# Altium schematic sheet FC_RGB.SchDoc
size A2; SheetNumber: 1; SheetTotal: 1
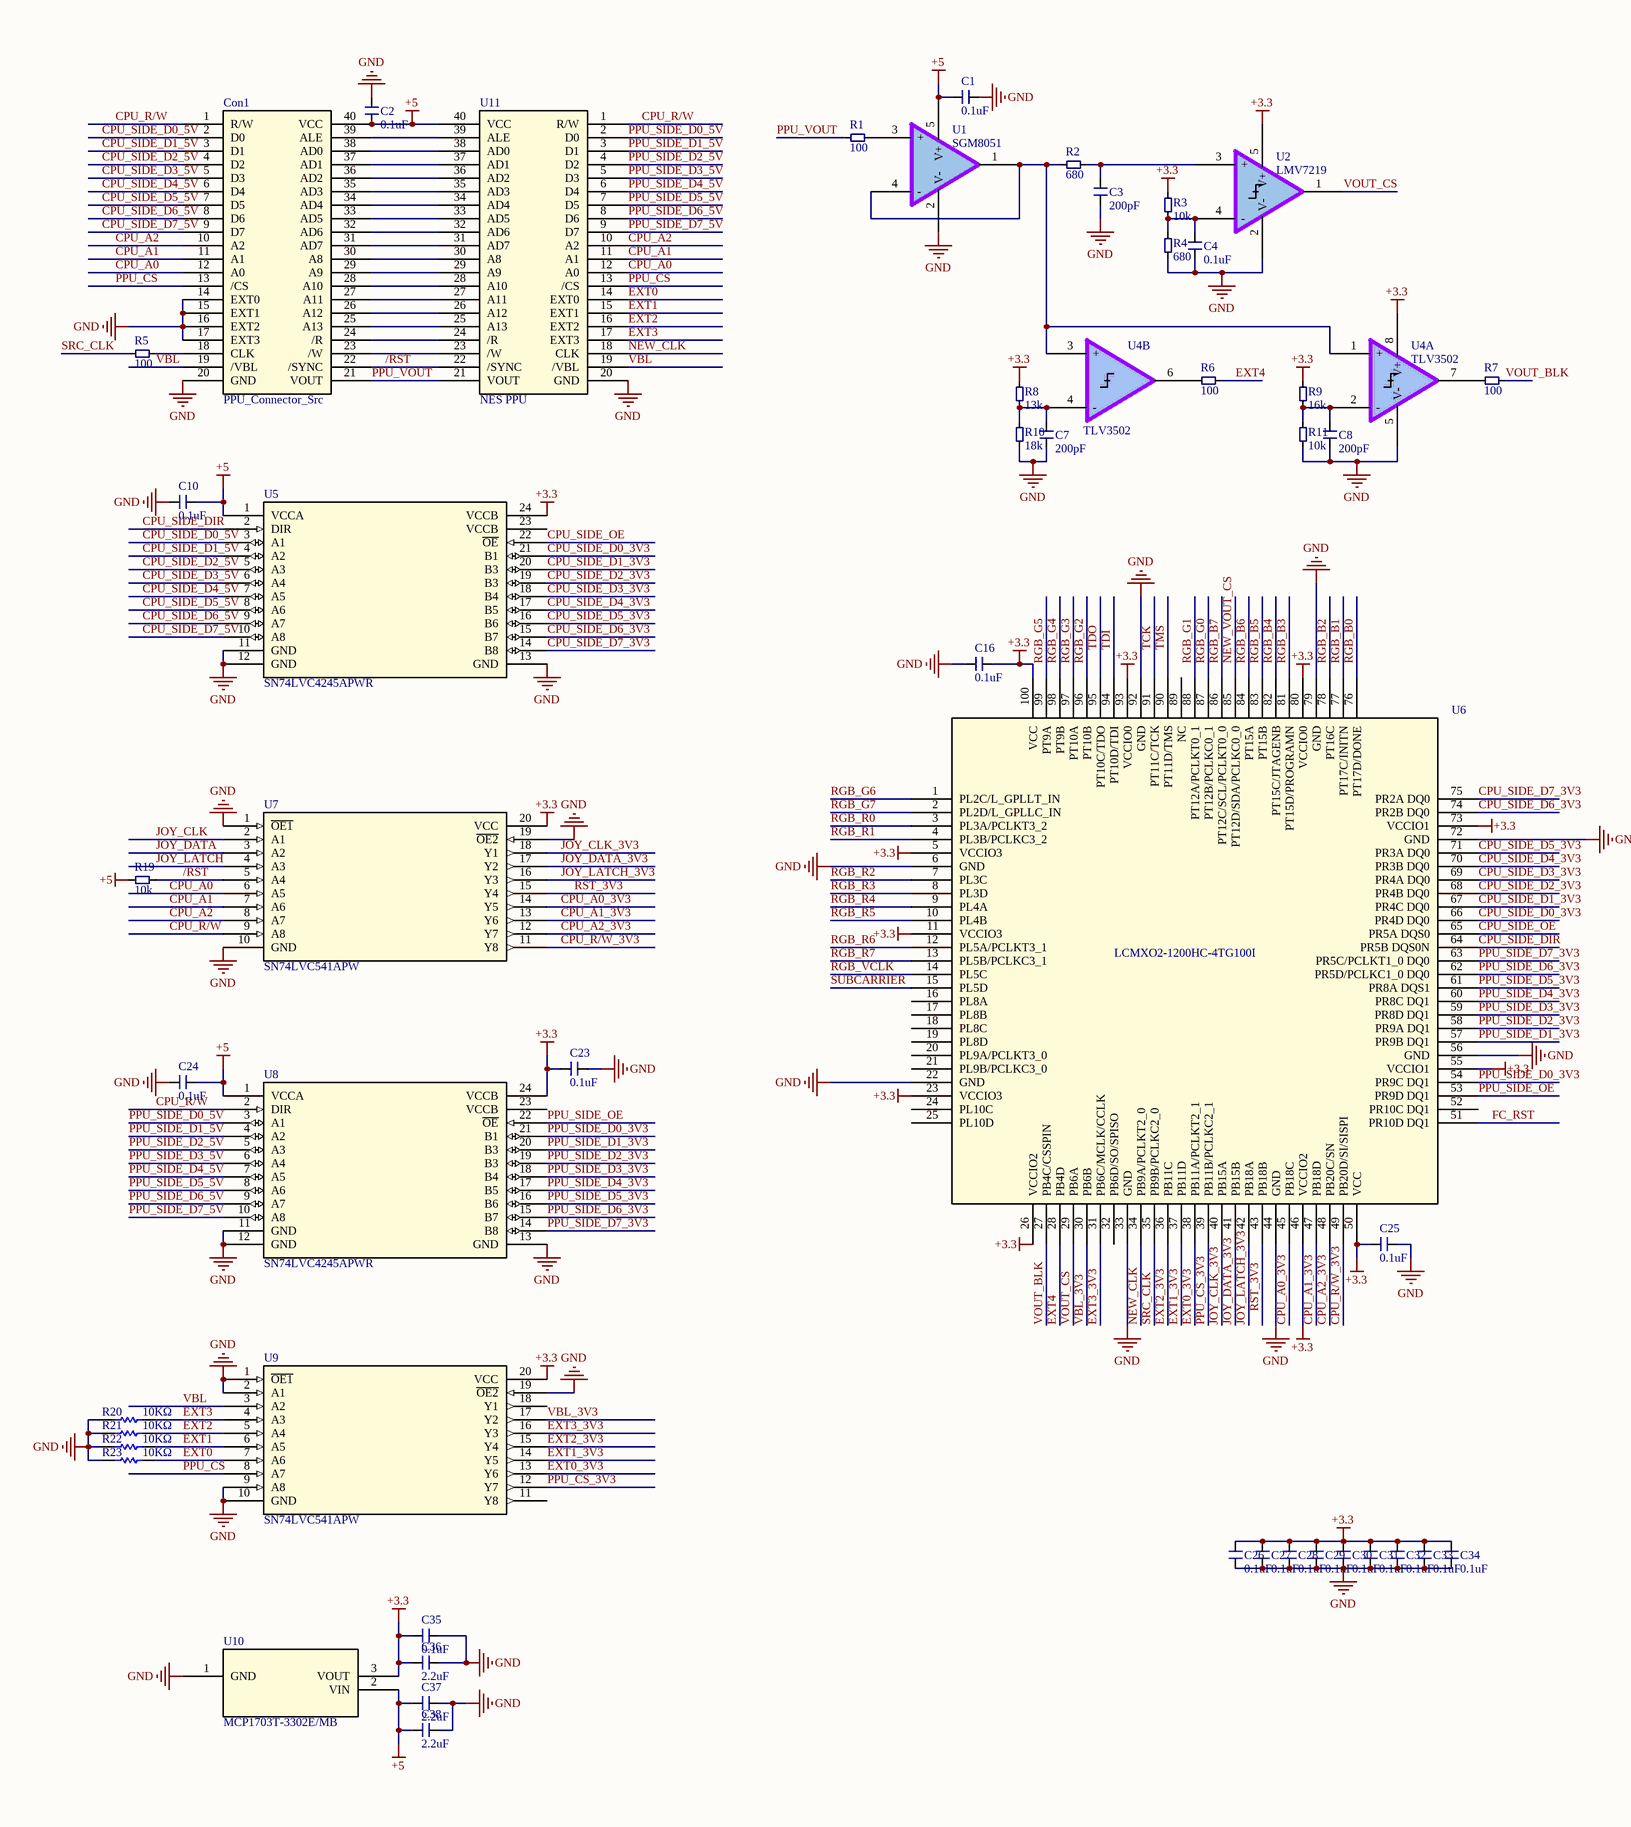
[diagram p0: FC_RGB.SchDoc, left]
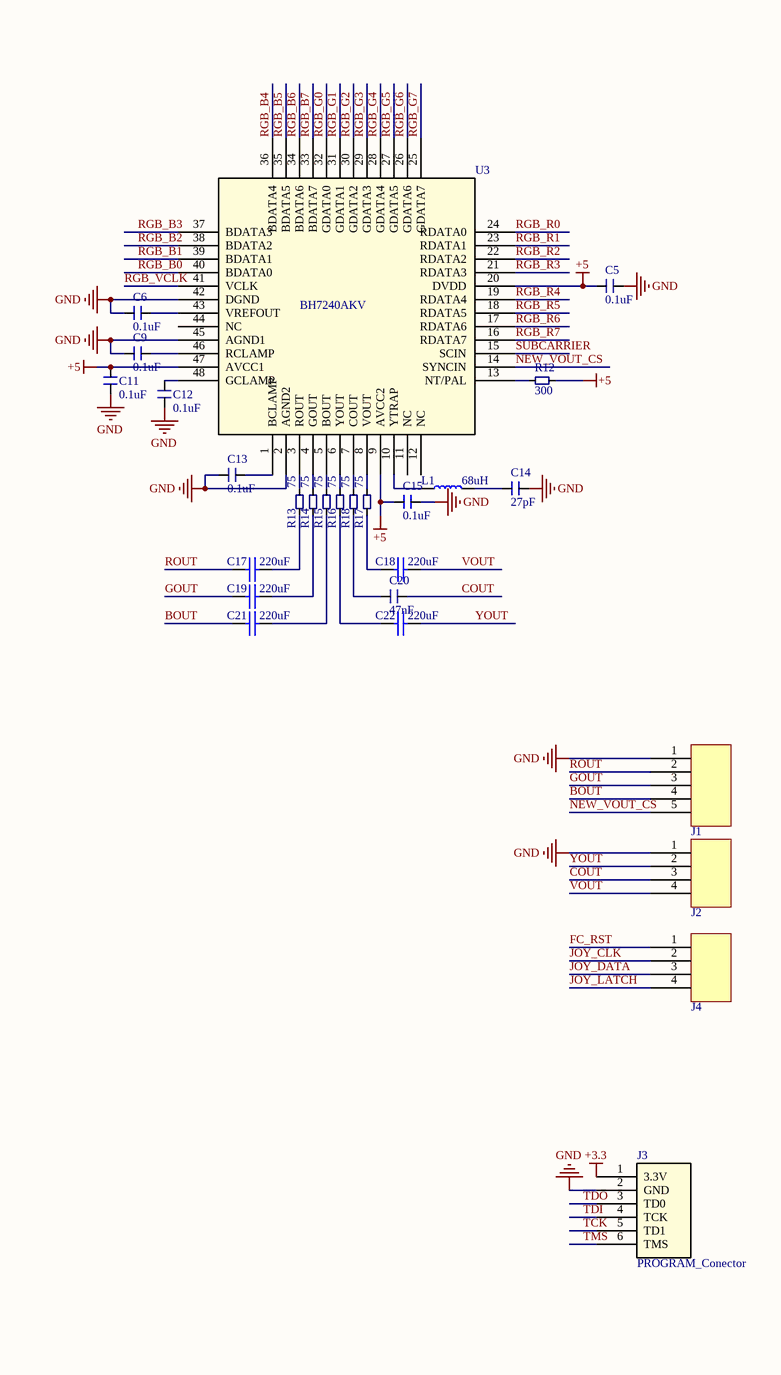
[diagram p1: FC_RGB.SchDoc, right]

## Parts
C1  value 0.1uF  [C0402]  (hidden comment: Cap)
C2  value 0.1uF  [C0805]  (hidden comment: Cap)
C3  value 200pF  [C0402]  (hidden comment: Cap)
C4  value 0.1uF  [C0402]  (hidden comment: Cap)
C5  value 0.1uF  [C0402]  (hidden comment: CAP)
C6  value 0.1uF  [C0402]  (hidden comment: CAP)
C7  value 200pF  [C0402]  (hidden comment: Cap)
C8  value 200pF  [C0402]  (hidden comment: Cap)
C9  value 0.1uF  [C0402]  (hidden comment: CAP)
C10  value 0.1uF  [C0402]  (hidden comment: CAP)
C11  value 0.1uF  [C0402]  (hidden comment: CAP)
C12  value 0.1uF  [C0402]  (hidden comment: CAP)
C13  value 0.1uF  [C0402]  (hidden comment: CAP)
C14  value 27pF  [C0402]  (hidden comment: CAP)
C15  value 0.1uF  [C0402]  (hidden comment: CAP)
C16  value 0.1uF  [C0402]  (hidden comment: Cap)
C17  220uF  [C 1206_L]
C18  220uF  [C 1206_L]
C19  220uF  [C 1206_L]
C20  value 47nF  [C0402]  (hidden comment: CAP)
C21  220uF  [C 1206_L]
C22  220uF  [C 1206_L]
C23  value 0.1uF  [C0402]  (hidden comment: CAP)
C24  value 0.1uF  [C0402]  (hidden comment: CAP)
C25  value 0.1uF  [C0402]  (hidden comment: Cap)
C26  value 0.1uF  [C0402]  (hidden comment: CAP)
C27  value 0.1uF  [C0402]  (hidden comment: CAP)
C28  value 0.1uF  [C0402]  (hidden comment: CAP)
C29  value 0.1uF  [C0402]  (hidden comment: CAP)
C30  value 0.1uF  [C0402]  (hidden comment: CAP)
C31  value 0.1uF  [C0402]  (hidden comment: CAP)
C32  value 0.1uF  [C0402]  (hidden comment: CAP)
C33  value 0.1uF  [C0402]  (hidden comment: CAP)
C34  value 0.1uF  [C0402]  (hidden comment: CAP)
C35  value 0.1uF  [C0603]  (hidden comment: Cap)
C36  value 2.2uF  [C0603]  (hidden comment: Cap)
C37  value 2.2uF  [C0805]  (hidden comment: Cap)
C38  value 2.2uF  [C0805]  (hidden comment: Cap)
Con1  PPU_Connector_Src  [DIP40_SRC]
J1  CN  [CN5_1.25_90]  (value not drawn)
J2  CN  [CN4_1.25_90]  (value not drawn)
J3  PROGRAM_Conector  [CON_PROGRAM]
J4  CN  [CN4_1.25_90]  (value not drawn)
L1  68uH  [L 0805]
R1  value 100  [R-0402]  (hidden comment: RES_SMD)
R2  value 680  [R-0402]  (hidden comment: RES_SMD)
R3  value 10k  [R-0402]  (hidden comment: RES_SMD)
R4  value 680  [R-0402]  (hidden comment: RES_SMD)
R5  value 100  [R-0402]  (hidden comment: RES_SMD)
R6  value 100  [R-0402]  (hidden comment: RES_SMD)
R7  value 100  [R-0402]  (hidden comment: RES_SMD)
R8  value 13k  [R-0402]  (hidden comment: RES_SMD)
R9  value 16k  [R-0402]  (hidden comment: RES_SMD)
R10  value 18k  [R-0402]  (hidden comment: RES_SMD)
R11  value 10k  [R-0402]  (hidden comment: RES_SMD)
R12  value 300  [R-0402]  (hidden comment: RES_SMD)
R13  value 75  [R-0402]  (hidden comment: RES_SMD)
R14  value 75  [R-0402]  (hidden comment: RES_SMD)
R15  value 75  [R-0402]  (hidden comment: RES_SMD)
R16  value 75  [R-0402]  (hidden comment: RES_SMD)
R17  value 75  [R-0402]  (hidden comment: RES_SMD)
R18  value 75  [R-0402]  (hidden comment: RES_SMD)
R19  value 10k  [R-0402]  (hidden comment: RES_SMD)
R20  10KΩ  [0603_R]
R21  10KΩ  [0603_R]
R22  10KΩ  [0603_R]
R23  10KΩ  [0603_R]
U1  SGM8051  [SOT-23-5]
U2  LMV7219  [SOT-23-5]
U3  BH7240AKV  [LQFP48-7*7]
U4  TLV3502  [SOP-8-SMALL]  (parts A,B of 2)
U5  SN74LVC4245APWR  [TSSOP24]
U6  LCMXO2-1200HC-4TG100I  [TQFP100_LAT]
U7  SN74LVC541APW  [TSSOP20]
U8  SN74LVC4245APWR  [TSSOP24]
U9  SN74LVC541APW  [TSSOP20]
U10  MCP1703T-3302E/MB  [SOT-89_3MC_MCH]
U11  NES PPU  [PDIP-40-BP]

## Nets
+3.3: C16.2 C23.2 C25.1 C26.1 C27.1 C28.1 C29.1 C30.1 C31.1 C32.1 C33.1 C34.1 C35.1 C36.1 J3.1(3.3V) R3.2 R8.2 R9.2 U2.5(V+) U4.8(V+) U5.24(VCCB) U6.5(VCCIO3) U6.11(VCCIO3) U6.23(VCCIO3) U6.26(VCCIO2) U6.46(VCCIO2) U6.50(VCC) U6.55(VCCIO1) U6.73(VCCIO1) U6.80(VCCIO0) U6.93(VCCIO0) U6.100(VCC) U7.20(VCC) U8.24(VCCB) U9.20(VCC) U10.3(VOUT)
+5: C1.1 C2.1 C5.2 C10.1 C11.2 C15.2 C24.1 C37.1 C38.1 Con1.40(VCC) R12.1 R19.2 U1.5(V+) U3.9(AVCC2) U3.20(DVDD) U3.47(AVCC1) U5.1(VCCA) U8.1(VCCA) U10.2(VIN) U11.40(VCC)
GND: C1.2 C2.2 C3.1 C4.1 C5.1 C6.1 C7.1 C8.1 C9.1 C10.2 C11.1 C12.1 C13.2 C14.1 C15.1 C16.1 C23.1 C24.2 C25.2 C26.2 C27.2 C28.2 C29.2 C30.2 C31.2 C32.2 C33.2 C34.2 C35.2 C36.2 C37.2 C38.2 Con1.14(EXT0) Con1.15(EXT1) Con1.16(EXT2) Con1.17(EXT3) Con1.20(GND) J1.1 J2.1 J3.2(GND) R4.1 R10.1 R11.1 R20.1 R21.1 R22.1 R23.1 U1.2(V-) U2.2(V-) U3.2(AGND2) U3.42(DGND) U3.45(AGND1) U4.5(V-) U5.11(GND) U5.12(GND) U5.13(GND) U6.6(GND) U6.22(GND) U6.33(GND) U6.44(GND) U6.56(GND) U6.72(GND) U6.79(GND) U6.92(GND) U7.1(~{OE1}) U7.10(GND) U7.19(~{OE2}) U8.11(GND) U8.12(GND) U8.13(GND) U9.1(~{OE1}) U9.2(A1) U9.9(A8) U9.10(GND) U9.19(~{OE2}) U10.1(GND) U11.20(GND)
/RST: Con1.22(/SYNC) R19.1 U7.5(A4) U11.22(/SYNC)
BOUT: C21.2 J1.4
COUT: C20.1 J2.3
CPU_A0: Con1.12(A0) U7.6(A5) U11.12(A0)
CPU_A0_3V3: U6.45(PB18C) U7.14(Y5)
CPU_A1: Con1.11(A1) U7.7(A6) U11.11(A1)
CPU_A1_3V3: U6.47(PB18D) U7.13(Y6)
CPU_A2: Con1.10(A2) U7.8(A7) U11.10(A2)
CPU_A2_3V3: U6.48(PB20C/SN) U7.12(Y7)
CPU_R/W: Con1.1(R/W) U7.9(A8) U8.2(DIR) U11.1(R/W)
CPU_R/W_3V3: U6.49(PB20D/SI/SISPI) U7.11(Y8)
CPU_SIDE_D0_3V3: U5.21(B1) U6.66(PR4D_DQ0)
CPU_SIDE_D0_5V: Con1.2(D0) U5.3(A1)
CPU_SIDE_D1_3V3: U5.20(B3) U6.67(PR4C_DQ0)
CPU_SIDE_D1_5V: Con1.3(D1) U5.4(A2)
CPU_SIDE_D2_3V3: U5.19(B3) U6.68(PR4B_DQ0)
CPU_SIDE_D2_5V: Con1.4(D2) U5.5(A3)
CPU_SIDE_D3_3V3: U5.18(B4) U6.69(PR4A_DQ0)
CPU_SIDE_D3_5V: Con1.5(D3) U5.6(A4)
CPU_SIDE_D4_3V3: U5.17(B5) U6.70(PR3B_DQ0)
CPU_SIDE_D4_5V: Con1.6(D4) U5.7(A5)
CPU_SIDE_D5_3V3: U5.16(B6) U6.71(PR3A_DQ0)
CPU_SIDE_D5_5V: Con1.7(D5) U5.8(A6)
CPU_SIDE_D6_3V3: U5.15(B7) U6.74(PR2B_DQ0)
CPU_SIDE_D6_5V: Con1.8(D6) U5.9(A7)
CPU_SIDE_D7_3V3: U5.14(B8) U6.75(PR2A_DQ0)
CPU_SIDE_D7_5V: Con1.9(D7) U5.10(A8)
CPU_SIDE_DIR: U5.2(DIR) U6.64(PR5B_DQS0N)
CPU_SIDE_OE: U5.22(~{OE}) U6.65(PR5A_DQS0)
EXT0: R23.2 U9.7(A6) U11.14(EXT0)
EXT0_3V3: U6.38(PB11A/PCLKT2_1) U9.13(Y6)
EXT1: R22.2 U9.6(A5) U11.15(EXT1)
EXT1_3V3: U6.37(PB11D) U9.14(Y5)
EXT2: R21.2 U9.5(A4) U11.16(EXT2)
EXT2_3V3: U6.36(PB11C) U9.15(Y4)
EXT3: R20.2 U9.4(A3) U11.17(EXT3)
EXT3_3V3: U6.31(PB6C/MCLK/CCLK) U9.16(Y3)
EXT4: R6.1 U6.28(PB4D)
FC_RST: J4.1 U6.51(PR10D_DQ1)
GOUT: C19.2 J1.3
JOY_CLK: J4.2 U7.2(A1)
JOY_CLK_3V3: U6.40(PB15A) U7.18(Y1)
JOY_DATA: J4.3 U7.3(A2)
JOY_DATA_3V3: U6.41(PB15B) U7.17(Y2)
JOY_LATCH: J4.4 U7.4(A3)
JOY_LATCH_3V3: U6.42(PB18A) U7.16(Y3)
NEW_CLK: U6.34(PB9A/PCLKT2_0) U11.18(CLK)
NEW_VOUT_CS: J1.5 U3.14(SYNCIN) U6.85(PT12D/SDA/PCLKC0_0)
PPU_CS: Con1.13(/CS) U9.8(A7) U11.13(/CS)
PPU_CS_3V3: U6.39(PB11B/PCLKC2_1) U9.12(Y7)
PPU_SIDE_D0_3V3: U6.54(PR9C_DQ1) U8.21(B1)
PPU_SIDE_D0_5V: U8.3(A1) U11.2(D0)
PPU_SIDE_D1_3V3: U6.57(PR9B_DQ1) U8.20(B3)
PPU_SIDE_D1_5V: U8.4(A2) U11.3(D1)
PPU_SIDE_D2_3V3: U6.58(PR9A_DQ1) U8.19(B3)
PPU_SIDE_D2_5V: U8.5(A3) U11.4(D2)
PPU_SIDE_D3_3V3: U6.59(PR8D_DQ1) U8.18(B4)
PPU_SIDE_D3_5V: U8.6(A4) U11.5(D3)
PPU_SIDE_D4_3V3: U6.60(PR8C_DQ1) U8.17(B5)
PPU_SIDE_D4_5V: U8.7(A5) U11.6(D4)
PPU_SIDE_D5_3V3: U6.61(PR8A_DQS1) U8.16(B6)
PPU_SIDE_D5_5V: U8.8(A6) U11.7(D5)
PPU_SIDE_D6_3V3: U6.62(PR5D/PCLKC1_0_DQ0) U8.15(B7)
PPU_SIDE_D6_5V: U8.9(A7) U11.8(D6)
PPU_SIDE_D7_3V3: U6.63(PR5C/PCLKT1_0_DQ0) U8.14(B8)
PPU_SIDE_D7_5V: U8.10(A8) U11.9(D7)
PPU_SIDE_OE: U6.53(PR9D_DQ1) U8.22(~{OE})
PPU_VOUT: Con1.21(VOUT) R1.1 U11.21(VOUT)
RGB_B0: U3.40(BDATA0) U6.76(PT17D/DONE)
RGB_B1: U3.39(BDATA1) U6.77(PT17C/INITN)
RGB_B2: U3.38(BDATA2) U6.78(PT16C)
RGB_B3: U3.37(BDATA3) U6.81(PT15D/PROGRAMN)
RGB_B4: U3.36(BDATA4) U6.82(PT15C/JTAGENB)
RGB_B5: U3.35(BDATA5) U6.83(PT15B)
RGB_B6: U3.34(BDATA6) U6.84(PT15A)
RGB_B7: U3.33(BDATA7) U6.86(PT12C/SCL/PCLKT0_0)
RGB_G0: U3.32(GDATA0) U6.87(PT12B/PCLKC0_1)
RGB_G1: U3.31(GDATA1) U6.88(PT12A/PCLKT0_1)
RGB_G2: U3.30(GDATA2) U6.96(PT10B)
RGB_G3: U3.29(GDATA3) U6.97(PT10A)
RGB_G4: U3.28(GDATA4) U6.98(PT9B)
RGB_G5: U3.27(GDATA5) U6.99(PT9A)
RGB_G6: U3.26(GDATA6) U6.1(PL2C/L_GPLLT_IN)
RGB_G7: U3.25(GDATA7) U6.2(PL2D/L_GPLLC_IN)
RGB_R0: U3.24(RDATA0) U6.3(PL3A/PCLKT3_2)
RGB_R1: U3.23(RDATA1) U6.4(PL3B/PCLKC3_2)
RGB_R2: U3.22(RDATA2) U6.7(PL3C)
RGB_R3: U3.21(RDATA3) U6.8(PL3D)
RGB_R4: U3.19(RDATA4) U6.9(PL4A)
RGB_R5: U3.18(RDATA5) U6.10(PL4B)
RGB_R6: U3.17(RDATA6) U6.12(PL5A/PCLKT3_1)
RGB_R7: U3.16(RDATA7) U6.13(PL5B/PCLKC3_1)
RGB_VCLK: U3.41(VCLK) U6.14(PL5C)
ROUT: C17.2 J1.2
RST_3V3: U6.43(PB18B) U7.15(Y4)
SRC_CLK: R5.2 U6.35(PB9B/PCLKC2_0)
SUBCARRIER: U3.15(SCIN) U6.15(PL5D)
TCK: J3.5(TD1) U6.91(PT11C/TCK)
TDI: J3.4(TCK) U6.94(PT10D/TDI)
TDO: J3.3(TD0) U6.95(PT10C/TDO)
TMS: J3.6(TMS) U6.90(PT11D/TMS)
VBL: Con1.19(/VBL) U9.3(A2) U11.19(/VBL)
VBL_3V3: U6.30(PB6B) U9.17(Y2)
VOUT: C18.1 J2.4
VOUT_BLK: R7.1 U6.27(PB4C/CSSPIN)
VOUT_CS: U2.1 U6.29(PB6A)
YOUT: C22.1 J2.2
NetC3_2: C3.2 R2.1 U2.3(+)
NetC4_2: C4.2 R3.1 R4.2 U2.4(-)
NetC6_2: C6.2 U3.43(VREFOUT)
NetC7_2: C7.2 R8.1 R10.2 U4.4(-)
NetC8_2: C8.2 R9.1 R11.2 U4.2(-)
NetC9_2: C9.2 U3.46(RCLAMP)
NetC12_2: C12.2 U3.48(GCLAMP)
NetC13_1: C13.1 U3.1(BCLAMP)
NetC14_2: C14.2 L1.2
NetC17_1: C17.1 R13.2
NetC18_2: C18.2 R17.2
NetC19_1: C19.1 R14.2
NetC20_2: C20.2 R18.2
NetC21_1: C21.1 R15.2
NetC22_2: C22.2 R16.2
NetCon1_18: Con1.18(CLK) R5.1
NetCon1_23: Con1.23(/W) U11.23(/W)
NetCon1_24: Con1.24(/R) U11.24(/R)
NetCon1_25: Con1.25(A13) U11.25(A13)
NetCon1_26: Con1.26(A12) U11.26(A12)
NetCon1_27: Con1.27(A11) U11.27(A11)
NetCon1_28: Con1.28(A10) U11.28(A10)
NetCon1_29: Con1.29(A9) U11.29(A9)
NetCon1_30: Con1.30(A8) U11.30(A8)
NetCon1_31: Con1.31(AD7) U11.31(AD7)
NetCon1_32: Con1.32(AD6) U11.32(AD6)
NetCon1_33: Con1.33(AD5) U11.33(AD5)
NetCon1_34: Con1.34(AD4) U11.34(AD4)
NetCon1_35: Con1.35(AD3) U11.35(AD3)
NetCon1_36: Con1.36(AD2) U11.36(AD2)
NetCon1_37: Con1.37(AD1) U11.37(AD1)
NetCon1_38: Con1.38(AD0) U11.38(AD0)
NetCon1_39: Con1.39(ALE) U11.39(ALE)
NetL1_1: L1.1 U3.10(YTRAP)
NetR1_2: R1.2 U1.3(+)
NetR2_2: R2.2 U1.1 U1.4(-) U4.1(+) U4.3(+)
NetR6_2: R6.2 U4.6
NetR7_2: R7.2 U4.7
NetR12_2: R12.2 U3.13(NT/PAL)
NetR13_1: R13.1 U3.3(ROUT)
NetR14_1: R14.1 U3.4(GOUT)
NetR15_1: R15.1 U3.5(BOUT)
NetR16_1: R16.1 U3.6(YOUT)
NetR17_1: R17.1 U3.8(VOUT)
NetR18_1: R18.1 U3.7(COUT)

Not connected (* = marked no-connect by the designer): U3 11(NC) 12(NC) 44(NC); U5 23(VCCB); U6 16(PL8A) 17(PL8B) 18(PL8C) 19(PL8D) 20(PL9A/PCLKT3_0) 21(PL9B/PCLKC3_0) 24(PL10C) 25(PL10D) 32(PB6D/SO/SPISO) 52(PR10C_DQ1) 89(NC); U8 23(VCCB); U9 11(Y8) 18(Y1)

## Library data of the parts
C17-C19 C21 C22 = C1206: No Description Available; Mfr_Name: Kemet; Manufacturer_Part_Number: C0603X394K4RACAUTO; Type: DEV; Copyright: Copyright (C) 2022 Ultra Librarian. All rights reserved.; RefDes: RefDes
J1 = CN5
J2 J4 = CN4
L1 = L0805
R20-R23 = R0603: No Description Available; Mfr_Name: Yageo; Manufacturer_Part_Number: RC0603FR-07200RL; Copyright: Copyright (C) 2022 Ultra Librarian. All rights reserved.; RefDes: RefDes; Type: DEV
U1 = SGM8051: High Speed OpAmp
U2 = LMV7219: High Speed Comparator
U3 = BH7240AKV: No Description Available; Mfr_Name: Analog Devices Inc; Manufacturer_Part_Number: ADV7123JSTZ330; Copyright: Copyright (C) 2022 Ultra Librarian. All rights reserved.; RefDes: RefDes; Type: DEV
U4 = TLV3502: 4.5ns Dual High-Speed Comparator
U5 U8 = 74LVC4245: LJ245A; Mfr_Name: Texas Instruments; Copyright: Copyright (C) 2022 Ultra Librarian. All rights reserved.; Manufacturer_Part_Number: SN74LVC4245APWR; RefDes: RefDes; Type: DEV
U6 = LCMXO2-1200HC: No Description Available; Mfr_Name: Lattice; Copyright: Copyright (C) 2023 Ultra Librarian. All rights reserved.; Manufacturer_Part_Number: LCMXO2-1200HC-4TG100I; RefDes: RefDes; Type: DEV
U7 U9 = 74LVC541: LC541A; Mfr_Name: Texas Instruments; Copyright: Copyright (C) 2022 Ultra Librarian. All rights reserved.; Manufacturer_Part_Number: SN74LVC541APW; RefDes: RefDes; Type: DEV
U10 = MCP1703T-3302E/MB: No Description Available; Mfr_Name: Microchip; Copyright: Copyright (C) 2022 Ultra Librarian. All rights reserved.; Manufacturer_Part_Number: MCP1703T-3302E/MB; RefDes: RefDes; Type: DEV
U11 = RP2C02: NES PPU RP2C02